# Altium schematic sheet Sensors.SchDoc
size A; DocumentNumber: 11; SheetNumber: 11
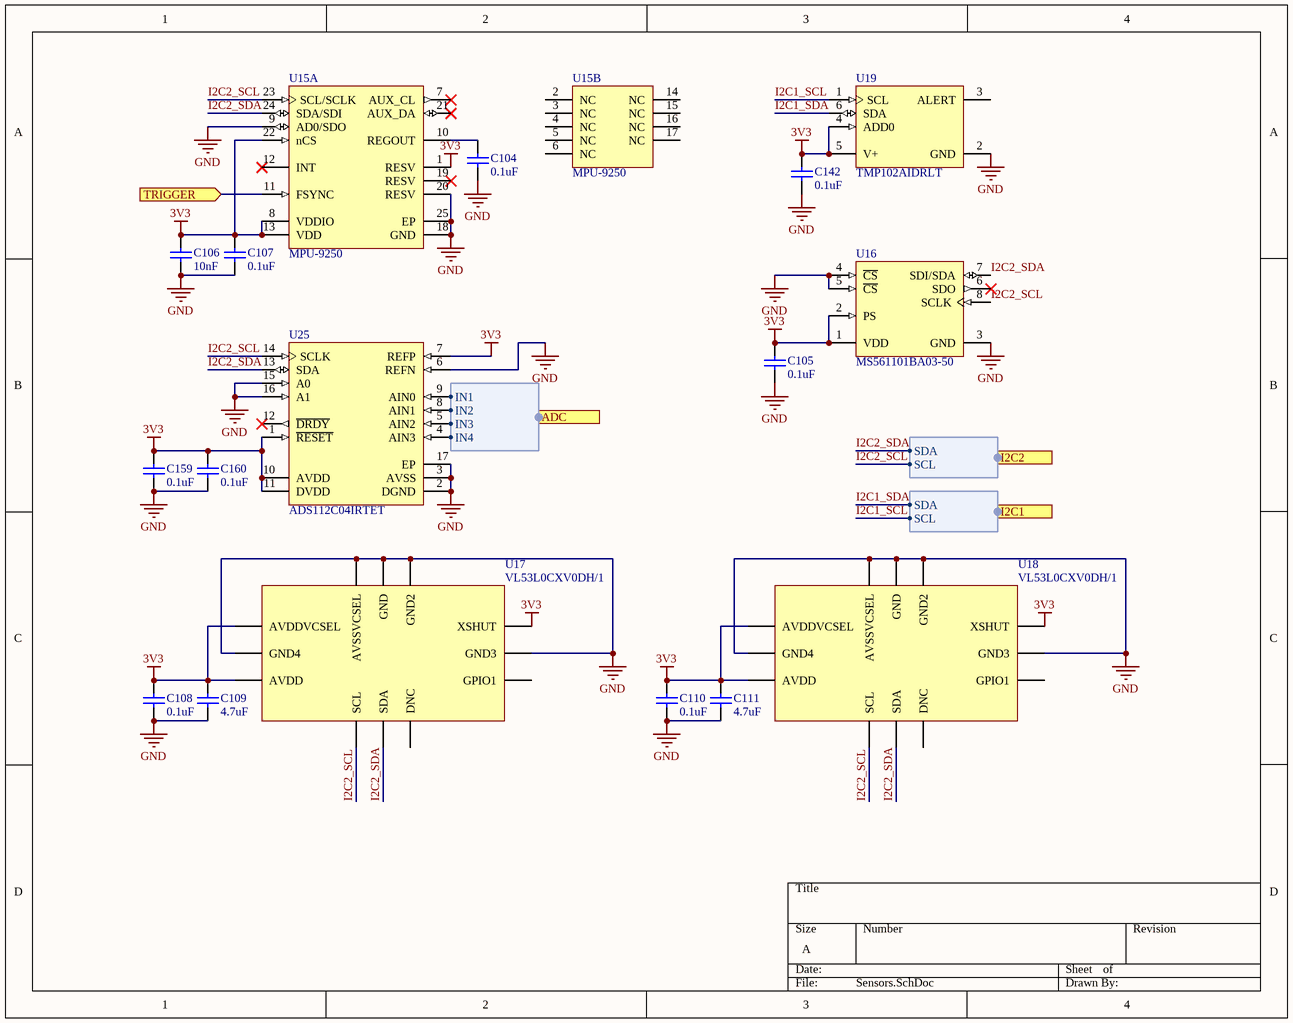
[diagram p0: Sensors.SchDoc]

## Parts
C104  value 0.1uF  [C0402[1005X55]]  (hidden comment: 0.1uF 6.3V 0402)
C105  value 0.1uF  [C0402[1005X55]]  (hidden comment: 0.1uF 6.3V 0402)
C106  value 10nF  [C0402[1005X55]]  (hidden comment: 10nF 50V 0402)
C107  value 0.1uF  [C0402[1005X55]]  (hidden comment: 0.1uF 6.3V 0402)
C108  value 0.1uF  [C0402[1005X55]]  (hidden comment: 0.1uF 6.3V 0402)
C109  value 4.7uF  [C0402[1005X55]]  (hidden comment: 4.7uF 6.3V 0402)
C110  value 0.1uF  [C0402[1005X55]]  (hidden comment: 0.1uF 6.3V 0402)
C111  value 4.7uF  [C0402[1005X55]]  (hidden comment: 4.7uF 6.3V 0402)
C142  value 0.1uF  [C0402[1005X55]]  (hidden comment: 0.1uF 6.3V 0402)
C159  value 0.1uF  [C0402[1005X55]]  (hidden comment: 0.1uF 6.3V 0402)
C160  value 0.1uF  [C0402[1005X55]]  (hidden comment: 0.1uF 6.3V 0402)
U15  MPU-9250  [QFN-24 (0.4MM)]  (parts A,B of 2)
U16  MS561101BA03-50  [QFN-8 (5x3MM)]
U17  VL53L0CXV0DH/1  [LGA-12]
U18  VL53L0CXV0DH/1  [LGA-12]
U19  TMP102AIDRLT  [SOT-563]
U25  ADS112C04IRTET  [QFN-16]

## Ports
ADC (harness ADC), I2C1 (harness I2C), I2C2 (harness I2C), TRIGGER (in)

## Harnesses
I2C: SCL, SDA
ADC: IN3, IN2, IN1, IN4

## Nets
3V3: C105.2 C106.2 C107.2 C108.2 C109.2 C110.2 C111.2 C142.2 C159.2 C160.2 U15.1(RESV) U15.8(VDDIO) U15.13(VDD) U15.22(nCS) U16.1(VDD) U16.2(PS) U17.1(AVDDVCSEL) U17.5(XSHUT) U17.11(AVDD) U18.1(AVDDVCSEL) U18.5(XSHUT) U18.11(AVDD) U19.4(ADD0) U19.5(V+) U25.1(~{RESET}) U25.7(REFP) U25.10(AVDD) U25.11(DVDD)
GND: C104.1 C105.1 C106.1 C107.1 C108.1 C109.1 C110.1 C111.1 C142.1 C159.1 C160.1 U15.9(AD0/SDO) U15.18(GND) U15.20(RESV) U15.25(EP) U16.3(GND) U16.4(~{CS}) U16.5(~{CS}) U17.2(AVSSVCSEL) U17.3(GND) U17.4(GND2) U17.6(GND3) U17.12(GND4) U18.2(AVSSVCSEL) U18.3(GND) U18.4(GND2) U18.6(GND3) U18.12(GND4) U19.2(GND) U25.2(DGND) U25.3(AVSS) U25.6(REFN) U25.15(A0) U25.16(A1) U25.17(EP)
I2C1_SCL: U19.1(SCL) ; port I2C1.SCL
I2C1_SDA: U19.6(SDA) ; port I2C1.SDA
I2C2_SCL: U15.23(SCL/SCLK) U16.8(SCLK) U17.10(SCL) U18.10(SCL) U25.14(SCLK) ; port I2C2.SCL
I2C2_SDA: U15.24(SDA/SDI) U16.7(SDI/SDA) U17.9(SDA) U18.9(SDA) U25.13(SDA) ; port I2C2.SDA
TRIGGER: U15.11(FSYNC) ; port TRIGGER
NetC104_2: C104.2 U15.10(REGOUT)
NetU25_4: U25.4(AIN3) ; port ADC.IN4
NetU25_5: U25.5(AIN2) ; port ADC.IN3
NetU25_8: U25.8(AIN1) ; port ADC.IN2
NetU25_9: U25.9(AIN0) ; port ADC.IN1

Not connected (* = marked no-connect by the designer): U15 2(NC) 3(NC) 4(NC) 5(NC) 6(NC) 7(AUX_CL)* 12(INT)* 14(NC) 15(NC) 16(NC) 17(NC) 19(RESV)* 21(AUX_DA)*; U16 6(SDO)*; U17 7(GPIO1) 8(DNC); U18 7(GPIO1) 8(DNC); U19 3(ALERT); U25 12(~{DRDY})*

## Library data of the parts
C104 C105 C107 C108 C110 C142 C159 C160 = CAP_0.1uF_6.3V_0402_10%: 0.1uF 6.3V 10% 0402 (1005 Metric); PartNumber: GRM155R70J104KA01D; Manufacturer: Murata; Mounting Technology: Surface Mount; PackageReference: 0402; PackageDescription: 0402 (1005 Metric); Voltage: 6.3V; Tolerance: 10%
C106 = CAP_10nF_50V_0402_10%: 10nF 50V 10% 0402 (1005 Metric); PartNumber: GCM155R71H103KA55D; Manufacturer: Murata; Mounting Technology: Surface Mount; PackageReference: 0402; PackageDescription: 0402 (1005 Metric); Voltage: 50V; Tolerance: 10%
C109 C111 = CAP_4.7uF_6.3V_0402_20%: 4.7uF 6.3V 20% 0402 (1005 Metric); PartNumber: GRM155R60J475ME47D; Manufacturer: Murata; Mounting Technology: Surface Mount; PackageReference: 0402; PackageDescription: 0402 (1005 Metric); Voltage: 6.3V; Tolerance: 20%
U15 = MPU-9250: Manufacturer: Invensense; PartNumber: MPU-9250; Mounting Technology: Surface Mount; PackageReference: QFN-24
U16 = MS561101BA03-50: BAROMETRIC PRESSURE SENSOR; Manufacturer: TE Connectivity Measurement Specialties; PartNumber: MS561101BA03-50; PackageReference: 8-SMD; Mounting Technology: Surface Mount
U17 U18 = VL53L0CXV0DH/1: Optical Sensor Modules Time-of-Flight (ToF) ranging sensor; Manufacturer: STMicroelectronics; PartNumber: VL53L0CXV0DH/1; Mounting Technology: Surface Mount; PackageReference: LGA-12
U19 = TMP102AIDRLT: SENSOR DIGITAL -40C-125C SOT563; Manufacturer: Texas Instruments; PackageReference: SOT-563; PartNumber: TMP102AIDRLT; Mounting Technology: Surface Mount
U25 = ADS112C04IRTET: IC ADC 16BIT I2C 1KSPS 16WQFN; Manufacturer: Texas Instruments; PackageReference: QFN-16; Mounting Technology: Surface Mount; PartNumber: ADS112C04IRTET